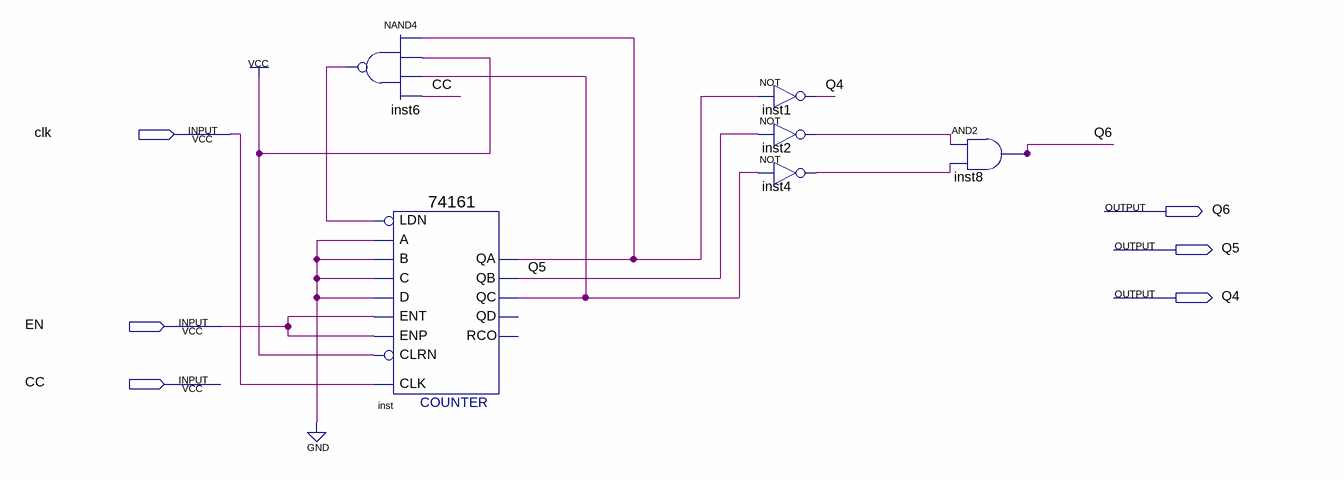
[diagram p0: schematic sheet]
// Quartus schematic M6.bdf as structural Verilog: 6 symbols, 6 pins
module M6 (
  input  clk,
  input  EN,
  input  CC,
  output Q6,
  output Q5,
  output Q4
);

  wire inst2_out, inst4_out, inst6_out, inst_qa, inst_qc;

  nand inst6 (inst6_out, inst_qa, 1'b1, inst_qc, CC);
  \74161  inst (
    .CLRN(1'b1), .CLK(clk), .ENP(EN), .LDN(inst6_out), .A(1'b0), .D(1'b0), .ENT(EN), .B(1'b0), .C(1'b0),
    .QC(inst_qc), .QB(Q5), .QA(inst_qa));  // open: QD, RCO
  not inst1 (Q4, inst_qa);
  not inst2 (inst2_out, Q5);
  not inst4 (inst4_out, inst_qc);
  and inst8 (Q6, inst2_out, inst4_out);
endmodule
